# EAGLE design Coprocessor_Board (EAGLE 8.4.0)
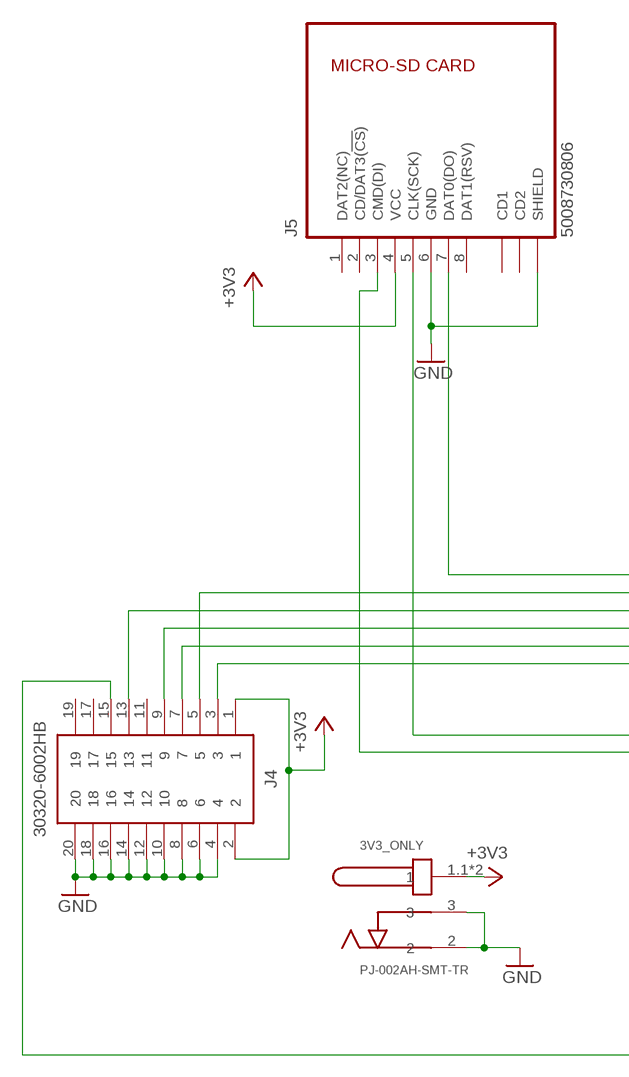
[diagram p0: schematic, sheet 1, part 1 of 2]
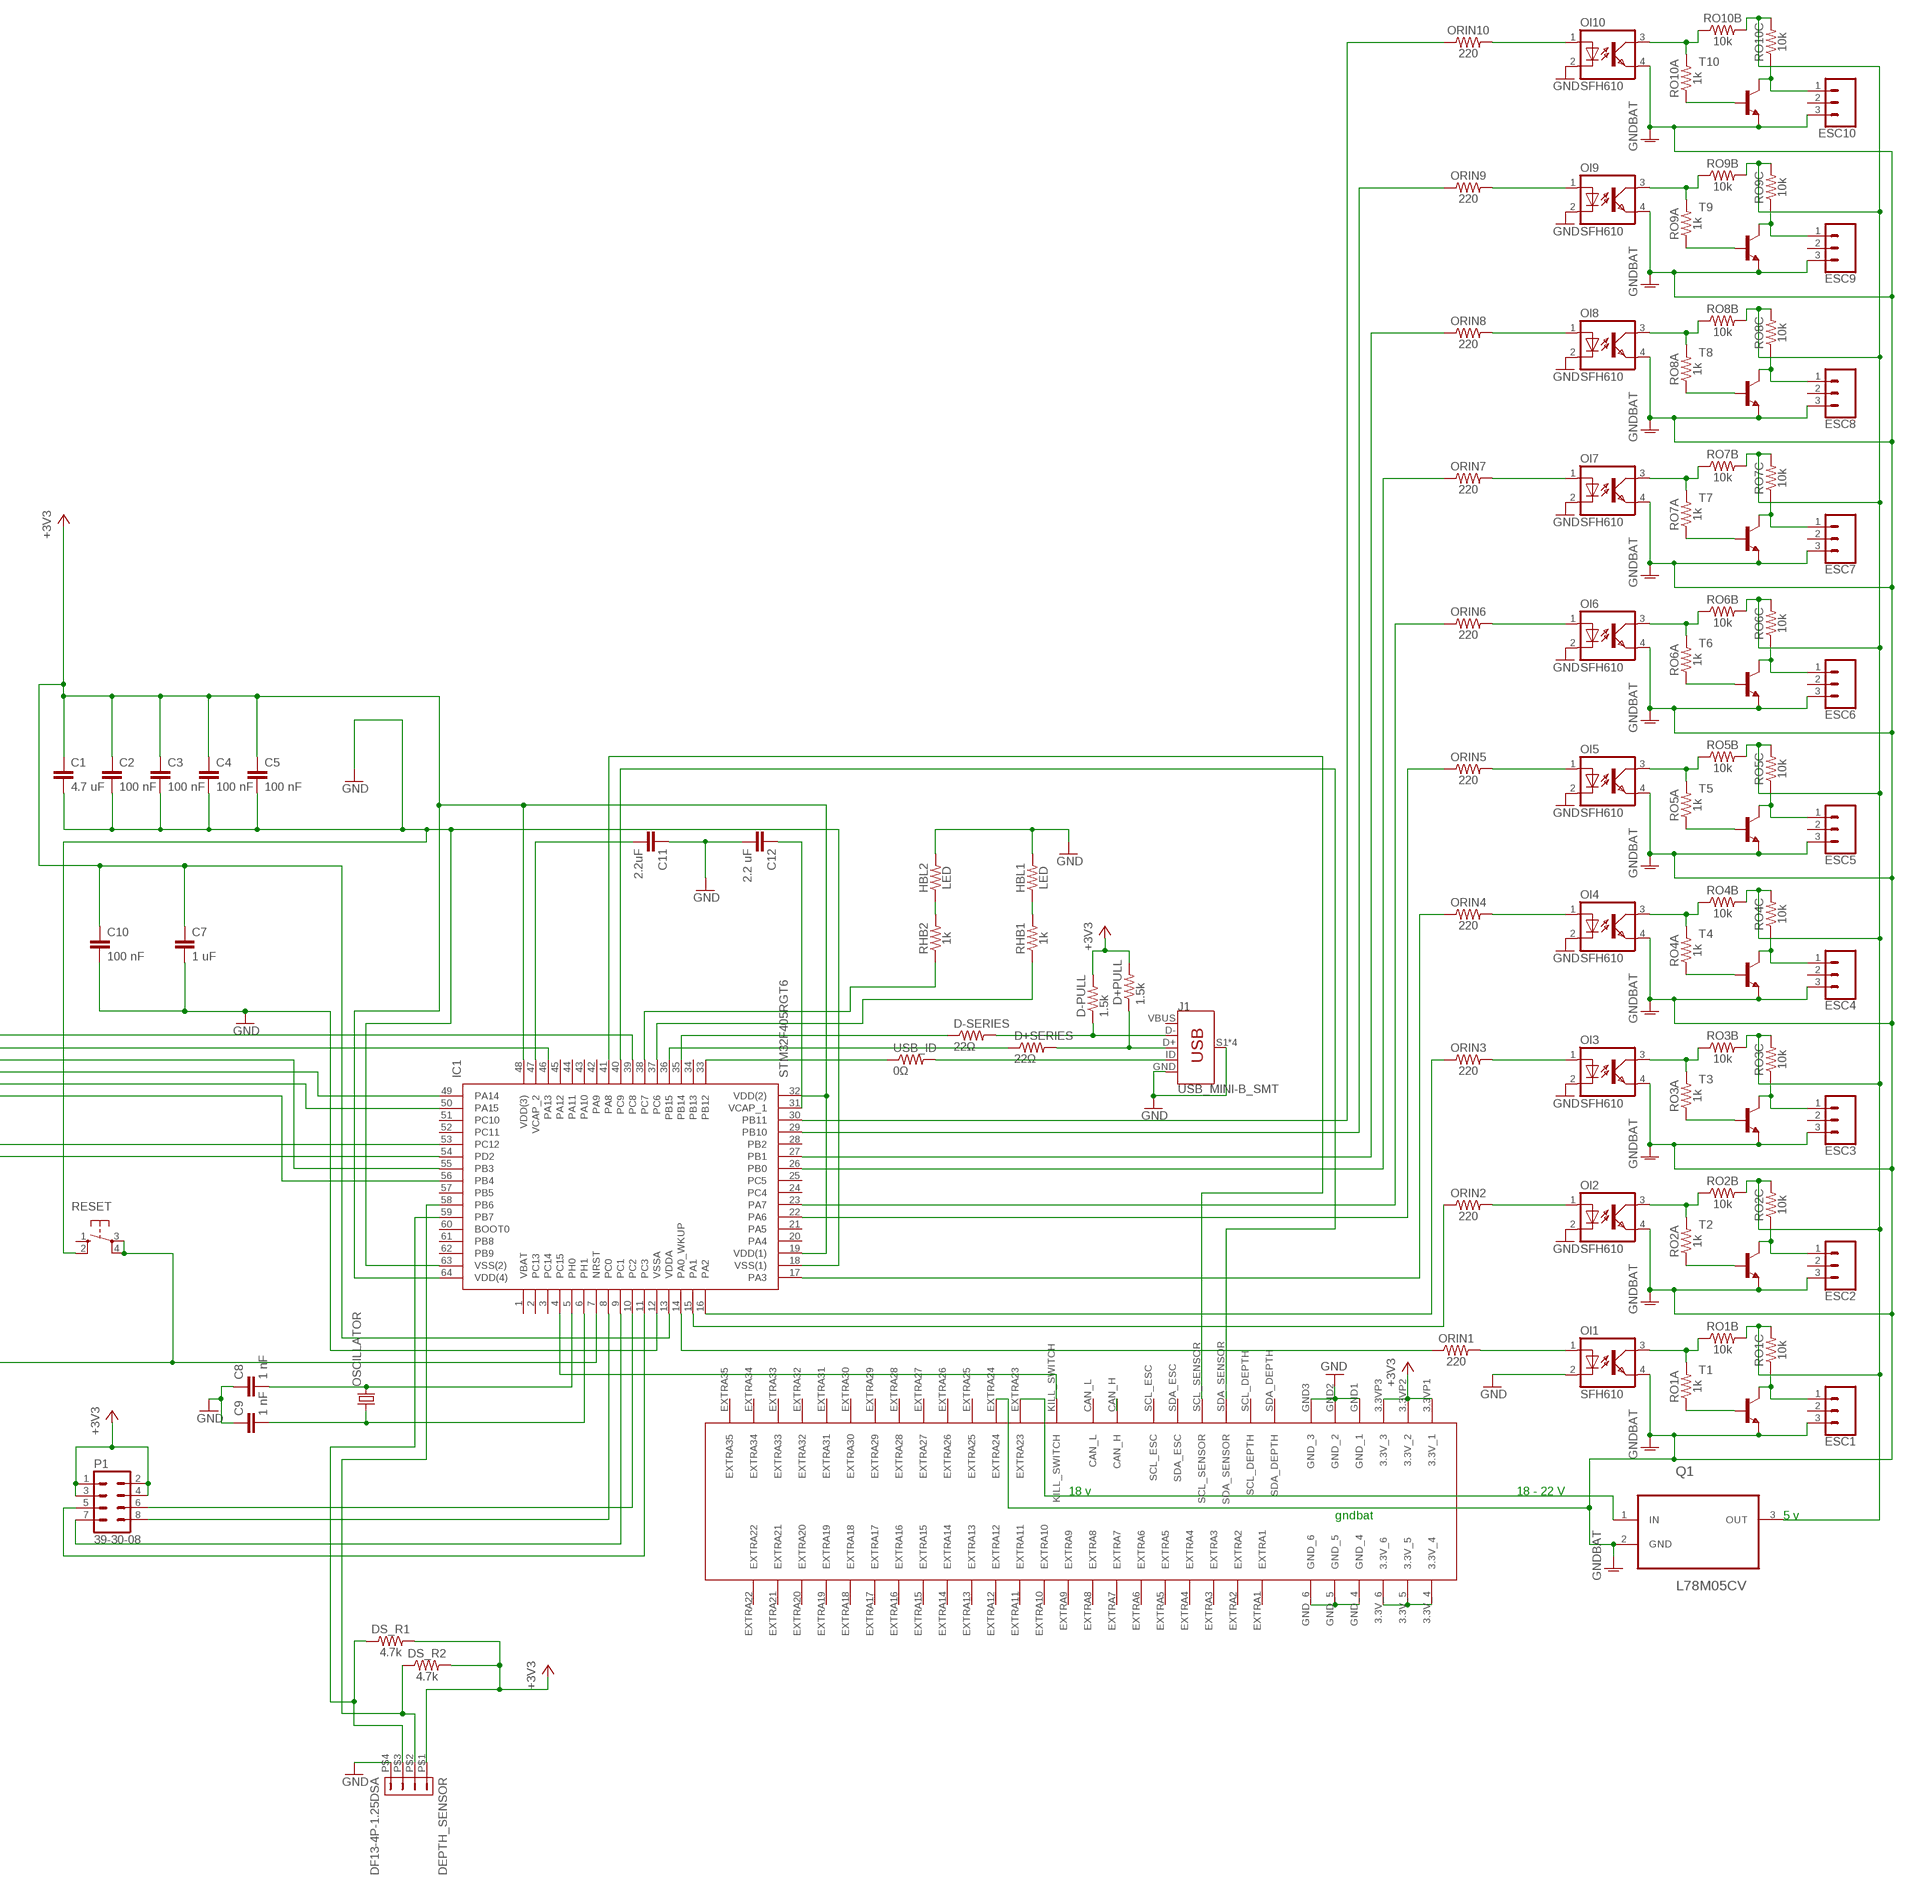
[diagram p1: schematic, sheet 1, part 2 of 2]

## Parts
3V3_ONLY  PJ-002AH-SMT-TR  [CUI_PJ-002AH-SMT-TR]
C1  4.7 uF  0.1UF-0603-100V-10%  [0603]
C2  100 nF  0.1UF-0603-100V-10%  [0603]
C3  100 nF  0.1UF-0603-100V-10%  [0603]
C4  100 nF  0.1UF-0603-100V-10%  [0603]
C5  100 nF  0.1UF-0603-100V-10%  [0603]
C7  1 uF  0.1UF-0603-100V-10%  [0603]
C8  1 nF  22PF-PTH-2.54MM-200V-5%  [CAP-PTH-2.54]
C9  1 nF  22PF-PTH-2.54MM-200V-5%  [CAP-PTH-2.54]
C10  100 nF  0.1UF-0603-100V-10%  [0603]
C11  2.2uF  0.1UF-0603-100V-10%  [0603]
C12  2.2 uF  0.1UF-0603-100V-10%  [0603]
D+PULL  1.5k  R-US_0204/7  [0204/7]
D+SERIES  22Ω  R-US_0204/7  [0204/7]
D-PULL  1.5k  R-US_0204/7  [0204/7]
D-SERIES  22Ω  R-US_0204/7  [0204/7]
DEPTH_SENSOR  DF13-4P-1.25DSA  [DF13-4P-1.25DSA]
DS_R1  4.7k  1KOHM-VERT-1/4W-1%  [AXIAL-0.1]
DS_R2  4.7k  1KOHM-VERT-1/4W-1%  [AXIAL-0.1]
ESC1  CONN_03  [1X03]
ESC2  CONN_03  [1X03]
ESC3  CONN_03  [1X03]
ESC4  CONN_03  [1X03]
ESC5  CONN_03  [1X03]
ESC6  CONN_03  [1X03]
ESC7  CONN_03  [1X03]
ESC8  CONN_03  [1X03]
ESC9  CONN_03  [1X03]
ESC10  CONN_03  [1X03]
HBL1  LED  1KOHM-VERT-1/4W-1%  [AXIAL-0.1]
HBL2  LED  1KOHM-VERT-1/4W-1%  [AXIAL-0.1]
IC1  STM32F405RGT6  [QFP50P1200X1200X160-64N]
J1  USB_MINI-B_SMT  [USB-MINIB]
J4  30320-6002HB  [SHDR20W81P254_2X10_3300X840X93]
J5  5008730806  [5008730806]
OI1  SFH610  [DIL04]
OI2  SFH610  [DIL04]
OI3  SFH610  [DIL04]
OI4  SFH610  [DIL04]
OI5  SFH610  [DIL04]
OI6  SFH610  [DIL04]
OI7  SFH610  [DIL04]
OI8  SFH610  [DIL04]
OI9  SFH610  [DIL04]
OI10  SFH610  [DIL04]
ORIN1  220  1KOHM-VERT-1/4W-1%  [AXIAL-0.1]
ORIN2  220  1KOHM-VERT-1/4W-1%  [AXIAL-0.1]
ORIN3  220  1KOHM-VERT-1/4W-1%  [AXIAL-0.1]
ORIN4  220  1KOHM-VERT-1/4W-1%  [AXIAL-0.1]
ORIN5  220  1KOHM-VERT-1/4W-1%  [AXIAL-0.1]
ORIN6  220  1KOHM-VERT-1/4W-1%  [AXIAL-0.1]
ORIN7  220  1KOHM-VERT-1/4W-1%  [AXIAL-0.1]
ORIN8  220  1KOHM-VERT-1/4W-1%  [AXIAL-0.1]
ORIN9  220  1KOHM-VERT-1/4W-1%  [AXIAL-0.1]
ORIN10  220  1KOHM-VERT-1/4W-1%  [AXIAL-0.1]
OSCILLATOR  CRYSTALHC49S  [HC49/S]
P1  39-30-08  [39-30-?08?]
Q1  L78M05CV  [TO254P450X1020X1935-3P]
RESET  10-XX  [B3F-10XX]
RHB1  1k  1KOHM-HORIZ-1/4W-1%  [AXIAL-0.3]
RHB2  1k  1KOHM-HORIZ-1/4W-5%  [AXIAL-0.3]
RO1A  1k  1KOHM-0603-1/10W-1%  [0603]
RO1B  10k  1KOHM-0603-1/10W-1%  [0603]
RO1C  10k  1KOHM-0603-1/10W-1%  [0603]
RO2A  1k  1KOHM-0603-1/10W-1%  [0603]
RO2B  10k  1KOHM-0603-1/10W-1%  [0603]
RO2C  10k  1KOHM-0603-1/10W-1%  [0603]
RO3A  1k  1KOHM-0603-1/10W-1%  [0603]
RO3B  10k  1KOHM-0603-1/10W-1%  [0603]
RO3C  10k  1KOHM-0603-1/10W-1%  [0603]
RO4A  1k  1KOHM-0603-1/10W-1%  [0603]
RO4B  10k  1KOHM-0603-1/10W-1%  [0603]
RO4C  10k  1KOHM-0603-1/10W-1%  [0603]
RO5A  1k  1KOHM-0603-1/10W-1%  [0603]
RO5B  10k  1KOHM-0603-1/10W-1%  [0603]
RO5C  10k  1KOHM-0603-1/10W-1%  [0603]
RO6A  1k  1KOHM-0603-1/10W-1%  [0603]
RO6B  10k  1KOHM-0603-1/10W-1%  [0603]
RO6C  10k  1KOHM-0603-1/10W-1%  [0603]
RO7A  1k  1KOHM-0603-1/10W-1%  [0603]
RO7B  10k  1KOHM-0603-1/10W-1%  [0603]
RO7C  10k  1KOHM-0603-1/10W-1%  [0603]
RO8A  1k  1KOHM-0603-1/10W-1%  [0603]
RO8B  10k  1KOHM-0603-1/10W-1%  [0603]
RO8C  10k  1KOHM-0603-1/10W-1%  [0603]
RO9A  1k  1KOHM-0603-1/10W-1%  [0603]
RO9B  10k  1KOHM-0603-1/10W-1%  [0603]
RO9C  10k  1KOHM-0603-1/10W-1%  [0603]
RO10A  1k  1KOHM-0603-1/10W-1%  [0603]
RO10B  10k  1KOHM-0603-1/10W-1%  [0603]
RO10C  10k  1KOHM-0603-1/10W-1%  [0603]
T1  -NPN-TO126V  [TO126V]
T2  -NPN-TO126V  [TO126V]
T3  -NPN-TO126V  [TO126V]
T4  -NPN-TO126V  [TO126V]
T5  -NPN-TO126V  [TO126V]
T6  -NPN-TO126V  [TO126V]
T7  -NPN-TO126V  [TO126V]
T8  -NPN-TO126V  [TO126V]
T9  -NPN-TO126V  [TO126V]
T10  -NPN-TO126V  [TO126V]
U$1  5530843  [5530843-6-BOARDFINGERS]
USB_ID  0Ω  R-US_0204/7  [0204/7]

## Nets
3.3V: 3V3_ONLY.1.1 3V3_ONLY.1.2 C1.1 C2.1 C3.1 C4.1 C5.1 C7.1 C10.1 D+PULL.2 D-PULL.2 DEPTH_SENSOR.P$1 DS_R1.P$2 DS_R2.P$2 IC1.13(VDDA) IC1.19(VDD(1)) IC1.32(VDD(2)) IC1.48(VDD(3)) IC1.64(VDD(4)) J4.1 J4.2 J5.4(VCC) P1.1 P1.2 P1.3 P1.4 U$1.3.3V_4 U$1.3.3V_5 U$1.3.3V_6 U$1.3.3VP1(3.3V_1) U$1.3.3VP2(3.3V_2) U$1.3.3VP3(3.3V_3) ; supply symbol labelled +3V3
5V: Q1.3(OUT) RO1B.2 RO1C.2 RO2B.2 RO2C.2 RO3B.2 RO3C.2 RO4B.2 RO4C.2 RO5B.2 RO5C.2 RO6B.2 RO6C.2 RO7B.2 RO7C.2 RO8B.2 RO8C.2 RO9B.2 RO9C.2 RO10B.2 RO10C.2
18V: Q1.1(IN) U$1.EXTRA23
CANH: U$1.CAN_H
D+CON: D+PULL.1 D+SERIES.2 J1.D+
D-CON: D-PULL.1 D-SERIES.2 J1.D-
DEPTHSCL: DEPTH_SENSOR.P$2 DS_R2.P$1 IC1.58(PB6)
DEPTHSDA: DEPTH_SENSOR.P$3 DS_R1.P$1 IC1.59(PB7)
GATE1: RO1A.1 T1.3(B)
GATE2: RO2A.1 T2.3(B)
GATE3: RO3A.1 T3.3(B)
GATE4: RO4A.1 T4.3(B)
GATE5: RO5A.1 T5.3(B)
GATE6: RO6A.1 T6.3(B)
GATE7: RO7A.1 T7.3(B)
GATE8: RO8A.1 T8.3(B)
GATE9: RO9A.1 T9.3(B)
GATE10: RO10A.1 T10.3(B)
GND: 3V3_ONLY.2 3V3_ONLY.3 C1.2 C2.2 C3.2 C4.2 C5.2 C7.2 C8.1 C9.1 C10.2 C11.1 C12.2 DEPTH_SENSOR.P$4 HBL1.P$2 HBL2.P$2 IC1.12(VSSA) IC1.18(VSS(1)) IC1.63(VSS(2)) J1.GND J1.S1(SHIELD) J1.S2(SHIELD) J1.S3(SHIELD) J1.S4(SHIELD) J4.4 J4.6 J4.8 J4.10 J4.12 J4.14 J4.16 J4.18 J4.20 J5.6(GND) J5.S3(SHIELD) J5.S4(SHIELD) OI1.2(C) OI2.2(C) OI3.2(C) OI4.2(C) OI5.2(C) OI6.2(C) OI7.2(C) OI8.2(C) OI9.2(C) OI10.2(C) RESET.2(S1) U$1.GND1(GND_1) U$1.GND2(GND_2) U$1.GND3(GND_3) U$1.GND_4 U$1.GND_5 U$1.GND_6
GNDBAT: ESC1.3 ESC2.3 ESC3.3 ESC4.3 ESC5.3 ESC6.3 ESC7.3 ESC8.3 ESC9.3 ESC10.3 OI1.4(EMIT) OI2.4(EMIT) OI3.4(EMIT) OI4.4(EMIT) OI5.4(EMIT) OI6.4(EMIT) OI7.4(EMIT) OI8.4(EMIT) OI9.4(EMIT) OI10.4(EMIT) Q1.2(GND) T1.1(E) T2.1(E) T3.1(E) T4.1(E) T5.1(E) T6.1(E) T7.1(E) T8.1(E) T9.1(E) T10.1(E) U$1.EXTRA24
HEARTBEAT_1: IC1.37(PC6) RHB1.P$1
HEARTBEAT_2: IC1.38(PC7) RHB2.P$1
HEAVE_PORT_AFT: IC1.27(PB1) ORIN8.P$1
HEAVE_PORT_FWD: IC1.26(PB0) ORIN7.P$1
HEAVE_STBD_AFT: IC1.23(PA7) ORIN6.P$1
HEAVE_STBD_FWD: IC1.22(PA6) ORIN5.P$1
JTAG15: IC1.7(NRST) J4.15 RESET.3(P) RESET.4(P1)
KILLSWITCH: IC1.4(PC15) U$1.KILL_SWITCH
MISSION_START: IC1.8(PC0) P1.8
N$1: HBL1.P$1 RHB1.P$2
N$14: HBL2.P$1 RHB2.P$2
OTG_ID: IC1.33(PB12) USB_ID.1
OTG_ID_CON: J1.ID USB_ID.2
POWER2O1: OI1.3(COL) RO1A.2 RO1B.1
POWER2O2: OI2.3(COL) RO2A.2 RO2B.1
POWER2O3: OI3.3(COL) RO3A.2 RO3B.1
POWER2O4: OI4.3(COL) RO4A.2 RO4B.1
POWER2O5: OI5.3(COL) RO5A.2 RO5B.1
POWER2O6: OI6.3(COL) RO6A.2 RO6B.1
POWER2O9: OI9.3(COL) RO9A.2 RO9B.1
POWER2O10: OI10.3(COL) RO10A.2 RO10B.1
POWER207: OI7.3(COL) RO7A.2 RO7B.1
POWER208: OI8.3(COL) RO8A.2 RO8B.1
PWM1: OI1.1(A) ORIN1.P$2
PWM2: OI2.1(A) ORIN2.P$2
PWM3: OI3.1(A) ORIN3.P$2
PWM4: OI4.1(A) ORIN4.P$2
PWM5: OI5.1(A) ORIN5.P$2
PWM6: OI6.1(A) ORIN6.P$2
PWM7: OI7.1(A) ORIN7.P$2
PWM8: OI8.1(A) ORIN8.P$2
PWM9: OI9.1(A) ORIN9.P$2
PWM10: OI10.1(A) ORIN10.P$2
RCC_OSC_IN: C8.2 IC1.5(PH0) OSCILLATOR.2
RCC_OSC_OUT: C9.2 IC1.6(PH1) OSCILLATOR.1
SCL_BKPLN: IC1.41(PA8) U$1.SCL_SENSOR
SDA_BKPLN: IC1.40(PC9) U$1.SDA_SENSOR
SDIO_CK: IC1.53(PC12) J5.5(CLK(SCK))
SDIO_CMD: IC1.54(PD2) J5.3(CMD(DI))
SDIO_DO: IC1.39(PC8) J5.7(DAT0(DO))
SOURCE1: ESC1.1 RO1C.1 T1.2(C)
SOURCE2: ESC2.1 RO2C.1 T2.2(C)
SOURCE3: ESC3.1 RO3C.1 T3.2(C)
SOURCE4: ESC4.1 RO4C.1 T4.2(C)
SOURCE5: ESC5.1 RO5C.1 T5.2(C)
SOURCE6: ESC6.1 RO6C.1 T6.2(C)
SOURCE7: ESC7.1 RO7C.1 T7.2(C)
SOURCE8: ESC8.1 RO8C.1 T8.2(C)
SOURCE9: ESC9.1 RO9C.1 T9.2(C)
SOURCE10: ESC10.1 RO10C.1 T10.2(C)
SURGEPORTHI: IC1.16(PA2) ORIN3.P$1
SURGEPORTLOW: IC1.17(PA3) ORIN4.P$1
SURGESTBDHI: IC1.14(PA0_WKUP) ORIN1.P$1
SURGESTBDLOW: IC1.15(PA1) ORIN2.P$1
SW_AFT: IC1.29(PB10) ORIN9.P$1
SW_FWD: IC1.30(PB11) ORIN10.P$1
SWITCH_3: IC1.9(PC1) P1.7
SWITCH_4: IC1.10(PC2) P1.6
SWITCH_5: IC1.11(PC3) P1.5
SYS_JTCK-SWCLK: IC1.49(PA14) J4.9
SYS_JTDI: IC1.50(PA15) J4.7
SYS_JTDO-SWO: IC1.55(PB3) J4.13
SYS_JTMS-SWIDIO: IC1.46(PA13) J4.5
SYS_JTRST: IC1.56(PB4) J4.3
USB_OTG_HS_DM: D-SERIES.1 IC1.35(PB14)
USB_OTG_HS_DP: D+SERIES.1 IC1.36(PB15)
VCAP: C11.2 IC1.47(VCAP_2)
VCAP2: C12.1 IC1.31(VCAP_1)
Unconnected: ESC1.2 ESC2.2 ESC3.2 ESC4.2 ESC5.2 ESC6.2 ESC7.2 ESC8.2 ESC9.2 ESC10.2 IC1.1(VBAT) IC1.2(PC13) IC1.3(PC14) IC1.20(PA4) IC1.21(PA5) IC1.24(PC4) IC1.25(PC5) IC1.28(PB2) IC1.34(PB13) IC1.42(PA9) IC1.43(PA10) IC1.44(PA11) IC1.45(PA12) IC1.51(PC10) IC1.52(PC11) IC1.57(PB5) IC1.60(BOOT0) IC1.61(PB8) IC1.62(PB9) J4.11 J4.17 J4.19 J5.1(DAT2(NC)) J5.2(CD/DAT3(!CS!)) J5.8(DAT1(RSV)) J5.CD1 J5.CD2 RESET.1(S) U$1.CAN_L U$1.EXTRA1 U$1.EXTRA2 U$1.EXTRA3 U$1.EXTRA4 U$1.EXTRA5 U$1.EXTRA6 U$1.EXTRA7 U$1.EXTRA8 U$1.EXTRA9 U$1.EXTRA10 U$1.EXTRA11 U$1.EXTRA12 U$1.EXTRA13 U$1.EXTRA14 U$1.EXTRA15 U$1.EXTRA16 U$1.EXTRA17 U$1.EXTRA18 U$1.EXTRA19 U$1.EXTRA20 U$1.EXTRA21 U$1.EXTRA22 U$1.EXTRA25 U$1.EXTRA26 U$1.EXTRA27 U$1.EXTRA28 U$1.EXTRA29 U$1.EXTRA30 U$1.EXTRA31 U$1.EXTRA32 U$1.EXTRA33 U$1.EXTRA34 U$1.EXTRA35 U$1.SCL_DEPTH U$1.SCL_ESC U$1.SDA_DEPTH U$1.SDA_ESC

## Notes on the sheet
- 18 v | 18 - 22 V
- gndbat | 5 v

## Power pins joined to a net without a drawn wire
VBUS: J1.VBUS

## Library data of the parts
3V3_ONLY = PJ-002AH-SMT-TR:PJ-002AH-SMT-TR: PJ-002 Series 2 x 6.5 mm 24 V Right Angle SMT Power Jack; AVAILABILITY: Good; DESCRIPTION: 24 VDC 5 A Surface Mount Unshielded 2 Conductors 3 Contacts Male Power Jack; MF: CUI; MP: PJ-002AH-SMT-TR; PACKAGE: None; PRICE: 0.98 USD
C1-C5 C7 C10-C12 = SparkFun-Capacitors:0.1UF: 0.1µF ceramic capacitors A capacitor is a passive two-terminal electrical component used to store electrical energy temporarily in an electric field.; PROD_ID: CAP-08390; VALUE: 0.1uF
C8 C9 = SparkFun-Capacitors:22PF: 22pF ceramic capacitors A capacitor is a passive two-terminal electrical component used to store electrical energy temporarily in an electric field.; PROD_ID: CAP-09128; VALUE: 22pF
D+PULL D+SERIES D-PULL D-SERIES USB_ID = resistor:R-US_: RESISTOR, American symbol
DEPTH_SENSOR = con-hirose-df13:DF13-4P-1.25: DF13-4P 1.25mm Pitch Miniature Crimping Connector.
DS_R1 DS_R2 HBL1 HBL2 ORIN1-ORIN10 = SparkFun-Resistors:1KOHM: 1kΩ resistor A resistor is a passive two-terminal electrical component that implements electrical resistance as a circuit element. Resistors act to reduce current flow, and, at the same time, act to lower voltage levels within circuits. - Wikipedia; PROD_ID: RES-12182; VALUE: 1k
ESC1-ESC10 = SparkFun-Connectors:CONN_03: Multi connection point. Often used as Generic Header-pin footprint for 0.1 inch spaced/style header connections On any of the 0.1 inch spaced packages, you can populate with these: Break Away Headers - Straight <https://www.sparkfun.com/products/116> (PRT-00116) Break Away Male Headers - Right Angle <https://www.sparkfun.com/products/553> (PRT-00553) Female Headers <https://www.sparkfun.com/products/115> (PRT-00115) Break Away Headers - Machine Pin <https://www.sparkfun.com/products/117> (PRT-00117) Break Away Female Headers - Swiss Machine Pin <https://www.sparkfun.com/products/743> (PRT-00743) Stackable Header - 3 Pin (Female, 0.1") <https://www.sparkfun.com/products/13875> (PRT-13875) For SCREWTERMINALS and SPRING TERMINALS visit here: Screw Terimnals on SparkFun.com <https://www.sparkfun.com/search/results?term=Screw+Terminals> (5mm/3.5mm/2.54mm spacing) This device is also useful as a general connection point to wire up your design to another part of your project. Our various solder wires solder well into these plated through hole pads. Hook-Up Wire - Assortment (Stranded, 22 AWG) <https://www.sparkfun.com/products/11375> (PRT-11375) Hook-Up Wire - Assortment (Solid Core, 22 AWG) <https://www.sparkfun.com/products/11367> (PRT-11367) View the entire wire category on our website here <https://www.sparkfun.com/categories/141> Special notes: Molex polarized connector foot print use with SKU : PRT-08232 with associated crimp pins and housings.; PROD_ID: XXX-00000; VALUE: 455-1750-1-ND
IC1 = STM32F405RGT6:STM32F405RGT6: MCU 32-Bit, ARM Cortex M4, 1MB Flash STMicroelectronics STM32F405RGT6, 32bit ARM Cortex M4F Microcontroller, 168MHz, 1024 kB Flash, 64-Pin LQFP <https://componentsearchengine.com/Images/3/STM32F405RGT6.jpg> Source: Datasheet <http://www.st.com/web/en/resource/technical/document/datasheet/DM00037051.pdf>; ALLIED_NUMBER: 70391099; DESCRIPTION: MCU 32-Bit, ARM Cortex M4, 1MB Flash STMicroelectronics STM32F405RGT6, 32bit ARM Cortex M4F Microcontroller, 168MHz, 1024 kB Flash, 64-Pin LQFP; HEIGHT: 1.6mm; MANUFACTURER_NAME: STMicroelectronics; MANUFACTURER_PART_NUMBER: STM32F405RGT6; RS_PART_NUMBER: 7468217; SUPPLIER_NAME: RS
J1 = SparkFun-Connectors:USB_MINI-B: USB type Mini-B Connector Breaks out 5th pin, and includes shield pins if needed. SparkFun Products: SparkFun FTDI Basic Breakout <https://www.sparkfun.com/products/9716> SparkFun XBee Explorer USB <https://www.sparkfun.com/products/11812> SparkFun Redboard <https://www.sparkfun.com/products/12757>; PROD_ID: CONN-08193; SF_ID: PRT-00587
J4 = 30320-6002HB:30320-6002HB: Header 20 position 3M 303 Series, 2.54mm Pitch 20 Way 2 Row Shrouded Straight PCB Header, Through Hole, Solder Termination <https://componentsearchengine.com/Images/3/30320-6002HB.jpg> Source: Datasheet <http://multimedia.3m.com/mws/media/22504O/3mtm-100-in-loprof-hdr-100x-100strt-ra-4-wall-ts0818.pdf>; DESCRIPTION: Header 20 position 3M 303 Series, 2.54mm Pitch 20 Way 2 Row Shrouded Straight PCB Header, Through Hole, Solder Termination; HEIGHT: 9.3mm; MANUFACTURER_NAME: 3M; MANUFACTURER_PART_NUMBER: 30320-6002HB; RS_PART_NUMBER: 8273587; SUPPLIER_NAME: RS
J5 = 5008730806:5008730806: micro SD Card Connector Molex; AVAILABILITY: Good; DESCRIPTION: Connector: for cards; SD Micro; push-push; SMT; gold plated; PIN: 8; MF: Molex; MP: 500873-0806; PACKAGE: None; PRICE: 2.47 USD
OI1-OI10 = optocoupler:SFH610: SIEMENS OPTO COUPLER; MF: VISHAY/TELEFUNKEN; MPN: SFH6106-4; OC_FARNELL: 1469568; OC_NEWARK: 58K2193
OSCILLATOR = crystal:CRYSTAL: CRYSTAL; OC_FARNELL: 1667008; OC_NEWARK: unknown
P1 = con-molex-mini-fit:39-30-?08?: HEADER
Q1 = L78M05CV:L78M05CV: Precision 500 mA regulators; AVAILABILITY: Good; DESCRIPTION: L78M05 Series 5 V 500 mA Three Terminal Positive Voltage Regulator - TO-220; MF: STMicroelectronics; MP: L78M05CV; PACKAGE: TO-220 STMicroelectronics; PRICE: 0.29 USD
RESET = switch-omron:10-XX: OMRON SWITCH; MPN: B3F-1000; OC_FARNELL: 176432; OC_NEWARK: 36M3542
RHB1 = SparkFun-Resistors:1KOHM: 1kΩ resistor A resistor is a passive two-terminal electrical component that implements electrical resistance as a circuit element. Resistors act to reduce current flow, and, at the same time, act to lower voltage levels within circuits. - Wikipedia; PROD_ID: RES-12182
RHB2 = SparkFun-Resistors:1KOHM: 1kΩ resistor A resistor is a passive two-terminal electrical component that implements electrical resistance as a circuit element. Resistors act to reduce current flow, and, at the same time, act to lower voltage levels within circuits. - Wikipedia; PROD_ID: RES-08380
RO1A RO2A RO3A RO4A RO5A RO6A RO7A RO8A RO9A RO10A = SparkFun-Resistors:1KOHM: 1kΩ resistor A resistor is a passive two-terminal electrical component that implements electrical resistance as a circuit element. Resistors act to reduce current flow, and, at the same time, act to lower voltage levels within circuits. - Wikipedia; PROD_ID: RES-07856
RO1B RO1C RO2B RO2C RO3B RO3C RO4B RO4C RO5B RO5C RO6B RO6C RO7B RO7C RO8B RO8C RO9B RO9C RO10B RO10C = SparkFun-Resistors:1KOHM: 1kΩ resistor A resistor is a passive two-terminal electrical component that implements electrical resistance as a circuit element. Resistors act to reduce current flow, and, at the same time, act to lower voltage levels within circuits. - Wikipedia; PROD_ID: RES-07856; VALUE: 1k
T1-T10 = transistor:*-NPN-: NPN Transistror BF959 corrected 2008.03.06
U$1 = 5530843-6:5530843

## Board
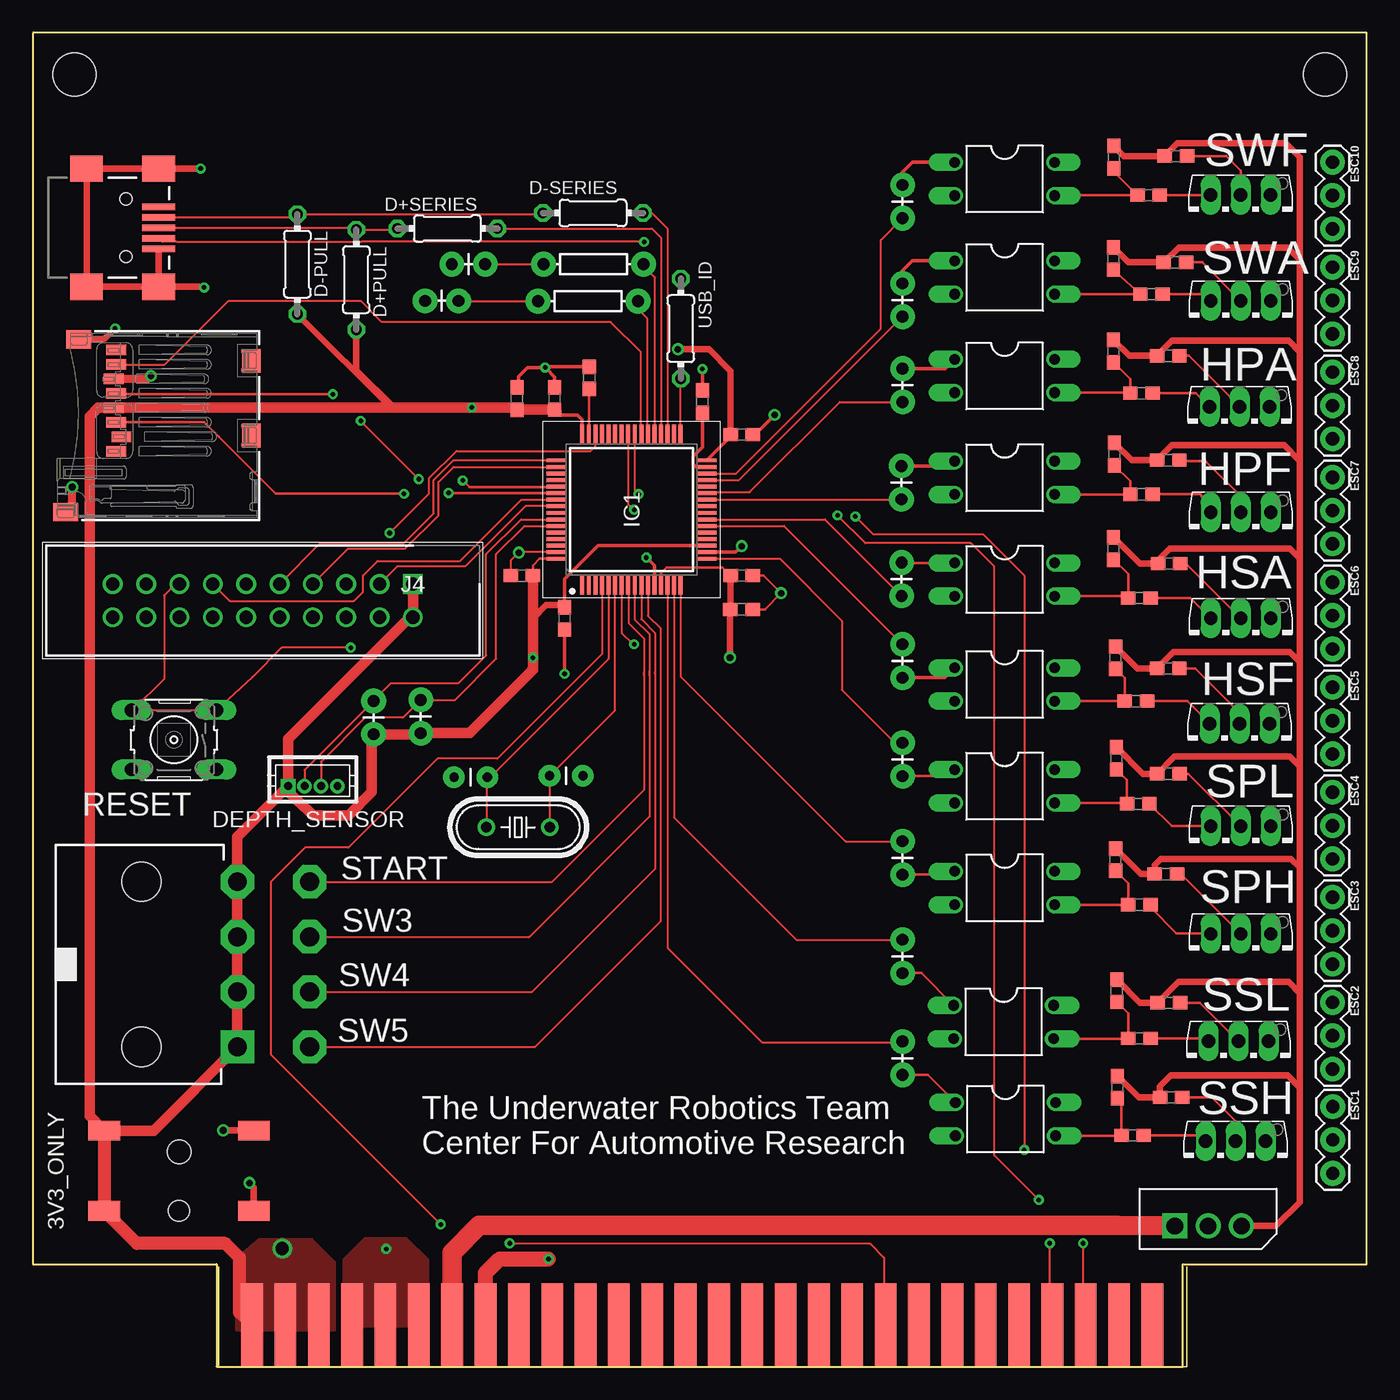
[diagram p2: board, top side]
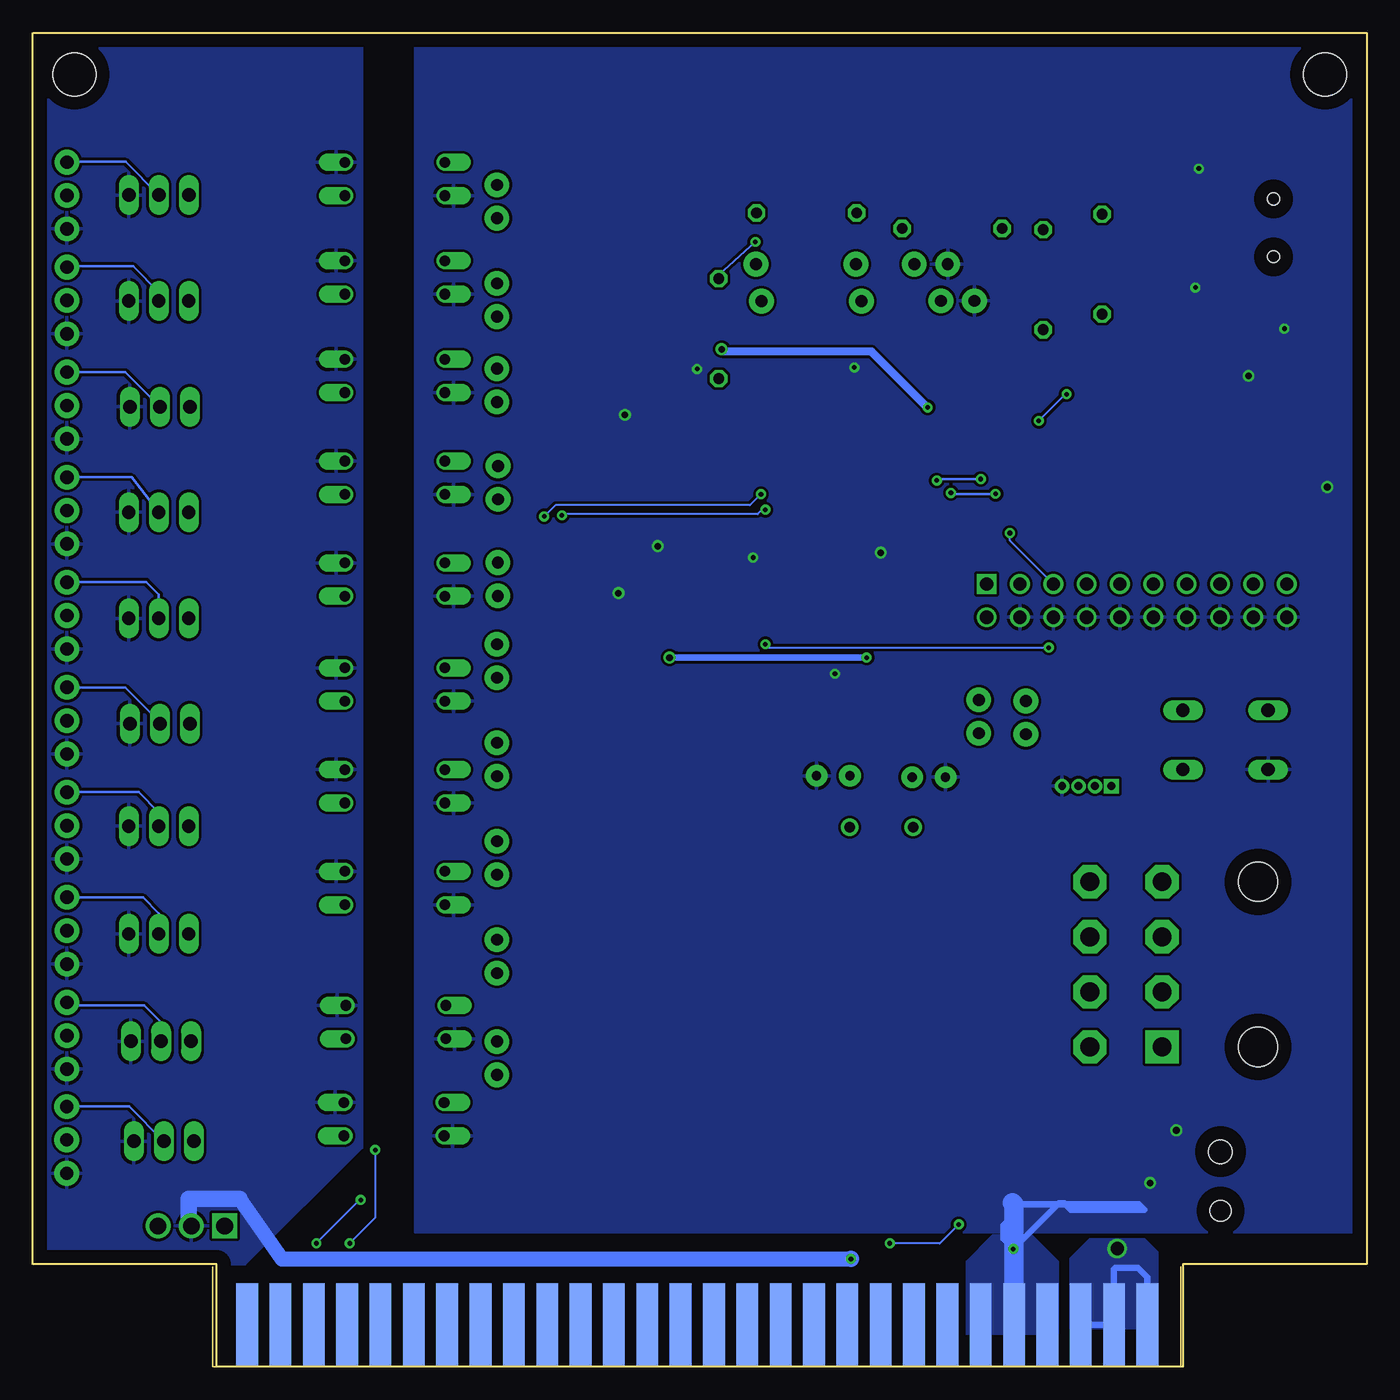
[diagram p3: board, bottom side, seen from below]

Size 101.6 x 101.6 mm. Coordinates in mm from the lower left corner, seen from the top.
Outline: 14,0 87.6,0 87.6,7.8 101.6,7.8 101.6,101.6 0,101.6 0,7.8 14,7.8 14,0
Copper layers (1*16): Top 0.035mm / dielectric 1.5mm / Bottom 0.035mm
Design rules "battery_balancer": minimum track width 6mil, minimum drill 0.35mm, track to track 0.205mm, track to pad 0.205mm, pad to pad 0.205mm, via to via 0.205mm, smd to smd 6mil, copper to edge 40mil, drill to drill 6mil, minimum pad ring 10mil, minimum via ring 8mil, stop-mask expansion 4mil, vias tented up to drill 0mil, thermal gap 10mil
Holes 3.26 mm at 3.17,98.42 98.42,98.42

### Footprints (pad centres in the part's own frame; a part is rotated, then mirrored left to right if it is on the bottom)
CUI_PJ-002AH-SMT-TR = smd 1.5 x 2.4: 1.1 -3.05,5.7; 1.2 3.05,5.7; 2 -3.05,-5.7; 3 3.05,-5.7 | hole 1.6: -3.05,0 | hole 1.8: 1.45,0
0603 = smd 1.1 x 1: 1 -0.85,0; 2 0.85,0
CAP-PTH-2.54 = drill 0.7 pad 1.651: 1 -1.27,0; 2 1.27,0
0204/7 = drill 0.813 octagon: 1 -3.81,0; 2 3.81,0
DF13-4P-1.25DSA = drill 0.6 pad 1.016 square: P$1 1.875,0 | drill 0.6 pad 1.016: P$2 0.625,0; P$3 -0.625,0; P$4 -1.875,0
AXIAL-0.1 = drill 0.9 pad 1.88: P$1 -1.27,0; P$2 1.27,0
1X03 = drill 1.016 pad 1.88: 1 0,0; 2 2.54,0; 3 5.08,0
QFP50P1200X1200X160-64N = smd 1.45 x 0.3: 1 -5.75,3.75; 2 -5.75,3.25; 3 -5.75,2.75; 4 -5.75,2.25; 5 -5.75,1.75; 6 -5.75,1.25; 7 -5.75,0.75; 8 -5.75,0.25; 9 -5.75,-0.25; 10 -5.75,-0.75; 11 -5.75,-1.25; 12 -5.75,-1.75; 13 -5.75,-2.25; 14 -5.75,-2.75; 15 -5.75,-3.25; 16 -5.75,-3.75; 33 5.75,-3.75; 34 5.75,-3.25; 35 5.75,-2.75; 36 5.75,-2.25; 37 5.75,-1.75; 38 5.75,-1.25; 39 5.75,-0.75; 40 5.75,-0.25; 41 5.75,0.25; 42 5.75,0.75; 43 5.75,1.25; 44 5.75,1.75; 45 5.75,2.25; 46 5.75,2.75; 47 5.75,3.25; 48 5.75,3.75 | smd 0.3 x 1.45: 17 -3.75,-5.75; 18 -3.25,-5.75; 19 -2.75,-5.75; 20 -2.25,-5.75; 21 -1.75,-5.75; 22 -1.25,-5.75; 23 -0.75,-5.75; 24 -0.25,-5.75; 25 0.25,-5.75; 26 0.75,-5.75; 27 1.25,-5.75; 28 1.75,-5.75; 29 2.25,-5.75; 30 2.75,-5.75; 31 3.25,-5.75; 32 3.75,-5.75; 49 3.75,5.75; 50 3.25,5.75; 51 2.75,5.75; 52 2.25,5.75; 53 1.75,5.75; 54 1.25,5.75; 55 0.75,5.75; 56 0.25,5.75; 57 -0.25,5.75; 58 -0.75,5.75; 59 -1.25,5.75; 60 -1.75,5.75; 61 -2.25,5.75; 62 -2.75,5.75; 63 -3.25,5.75; 64 -3.75,5.75
USB-MINIB = smd 2.5 x 0.5: D+ 2.5,0; D- 2.5,0.8; GND 2.5,-1.6; ID 2.5,-0.8; VBUS 2.5,1.6 | smd 2.5 x 2: S1 -3,4.5; S2 2.5,4.5; S3 -3,-4.5; S4 2.5,-4.5 | hole 0.9: 0,2.2; 0,-2.2
SHDR20W81P254_2X10_3300X840X93 = drill 1 pad 1.5 square: 1 0,0 | drill 1 pad 1.5: 2 0,2.54; 3 2.54,0; 4 2.54,2.54; 5 5.08,0; 6 5.08,2.54; 7 7.62,0; 8 7.62,2.54; 9 10.16,0; 10 10.16,2.54; 11 12.7,0; 12 12.7,2.54; 13 15.24,0; 14 15.24,2.54; 15 17.78,0; 16 17.78,2.54; 17 20.32,0; 18 20.32,2.54; 19 22.86,0; 20 22.86,2.54
5008730806 = smd 0.8 x 1.5: 1 -1.94,10.7; 2 -0.84,10.3; 3 0.26,10.7; 4 1.36,10.9; 5 2.46,10.7; 6 3.56,10.9; 7 4.66,10.7; 8 5.76,10.7 | smd 1.8 x 1.4: CD1 -0.75,0.4; CD2 4.95,0.4 | smd 1.4 x 1.9: S3 -6.575,14.55; S4 6.575,13.55
DIL04 = drill 0.813 offset: 1 -1.27,-3.81; 2 1.27,-3.81; 3 1.27,3.81; 4 -1.27,3.81
HC49/S = drill 0.813: 1 -2.413,0; 2 2.413,0
39-30-?08? = drill 1.422 pad 2.54 square: 1 6.287,0 | drill 1.422 pad 2.54 octagon: 2 2.095,0; 3 -2.095,0; 4 -6.287,0; 5 6.287,5.512; 6 2.095,5.512; 7 -2.095,5.512; 8 -6.287,5.512 | hole 3: -6.287,-7.3; 6.287,-7.3
TO254P450X1020X1935-3P = drill 1.27 square: 1 -5.08,-1.092 | drill 1.27: 2 -2.54,-1.092; 3 0,-1.092
B3F-10XX = drill 1.016 long: 1 -3.251,2.261; 2 3.251,2.261; 3 -3.251,-2.261; 4 3.251,-2.261
AXIAL-0.3 = drill 0.9 pad 1.88: P$1 -3.81,0; P$2 3.81,0
TO126V = drill 1.016 long: 1 -2.286,-1.27; 2 0,-1.27; 3 2.286,-1.27
5530843-6-BOARDFINGERS = smd 1.651 x 6.35 bottom: 3.3V_4 0.826,3.175; 3.3V_5 3.365,3.175; 3.3V_6 5.905,3.175; EXTRA1 16.066,3.175; EXTRA2 18.605,3.175; EXTRA3 21.145,3.175; EXTRA4 23.686,3.175; EXTRA5 26.226,3.175; EXTRA6 28.765,3.175; EXTRA7 31.305,3.175; EXTRA8 33.846,3.175; EXTRA9 36.386,3.175; EXTRA10 38.925,3.175; EXTRA11 41.465,3.175; EXTRA12 44.005,3.175; EXTRA13 46.545,3.175; EXTRA14 49.086,3.175; EXTRA15 51.626,3.175; EXTRA16 54.166,3.175; EXTRA17 56.706,3.175; EXTRA18 59.245,3.175; EXTRA19 61.785,3.175; EXTRA20 64.326,3.175; EXTRA21 66.865,3.175; EXTRA22 69.406,3.175; GND_4 8.445,3.175; GND_5 10.986,3.175; GND_6 13.525,3.175 | smd 1.651 x 6.35: 3.3VP1 0.826,3.175; 3.3VP2 3.365,3.175; 3.3VP3 5.905,3.175; CAN_H 51.626,3.175; CAN_L 54.166,3.175; EXTRA23 16.066,3.175; EXTRA24 18.605,3.175; EXTRA25 21.145,3.175; EXTRA26 23.686,3.175; EXTRA27 26.226,3.175; EXTRA28 28.765,3.175; EXTRA29 31.305,3.175; EXTRA30 33.846,3.175; EXTRA31 36.386,3.175; EXTRA32 38.925,3.175; EXTRA33 41.465,3.175; EXTRA34 44.005,3.175; EXTRA35 46.545,3.175; GND1 8.445,3.175; GND2 10.986,3.175; GND3 13.525,3.175; KILL_SWITCH 49.086,3.175; SCL_DEPTH 59.245,3.175; SCL_ESC 69.406,3.175; SCL_SENSOR 64.326,3.175; SDA_DEPTH 56.706,3.175; SDA_ESC 66.865,3.175; SDA_SENSOR 61.785,3.175

### Placement (x,y rotation side)
3V3_ONLY  11.14,14.93 90 top
C1  36.88,73.74 90 top
C2  39.75,73.75 90 top
C3  37.25,60.25 180 top
C4  40.5,57 270 top
C5  54,71 0 top
C7  54,60.25 0 top
C8  33.35,44.9 0 top
C9  40.63,45.01 180 top
C10  53.99,57.68 0 top
C11  42.38,75.32 270 top
C12  51,73.5 90 top
D+PULL  24.64,82.8 270 top
D+SERIES  31.58,86.69 180 top
D-PULL  20.15,83.98 270 top
D-SERIES  42.67,87.88 180 top
DEPTH_SENSOR  21.32,44.23 180 top
DS_R1  29.55,49.52 270 top
DS_R2  25.95,49.44 270 top
ESC1  99.01,19.81 270 top
ESC2  99,27.75 270 top
ESC3  99,35.75 270 top
ESC4  99,43.75 270 top
ESC5  99,51.75 270 top
ESC6  99,59.75 270 top
ESC7  99,67.75 270 top
ESC8  99,75.75 270 top
ESC9  99,83.75 270 top
ESC10  99,91.75 270 top
HBL1  33.19,83.98 180 top
HBL2  31.15,81.19 180 top
IC1  45.6,65.29 90 top
J1  7.09,86.75 0 top
J4  28.95,59.62 180 top
J5  17.06,71.67 90 top
OI1  74.09,18.85 270 top
OI2  73.94,26.26 270 top
OI3  74.03,36.46 270 top
OI4  74.03,44.21 270 top
OI5  74.03,51.96 270 top
OI6  74.03,59.96 270 top
OI7  74.03,67.71 270 top
OI8  74.03,75.46 270 top
OI9  74.03,82.96 270 top
OI10  74.03,90.46 270 top
ORIN1  66.25,23.5 270 top
ORIN2  66.25,31.25 270 top
ORIN3  66.25,38.75 270 top
ORIN4  66.25,46.25 270 top
ORIN5  66.25,53.75 270 top
ORIN6  66.18,59.98 90 top
ORIN7  66.17,67.34 90 top
ORIN8  66.25,74.75 90 top
ORIN9  66.25,81.25 90 top
ORIN10  66.25,88.75 90 top
OSCILLATOR  36.97,41.09 180 top
P1  39-30-08?  [39-30-?08?]  15.58,30.65 270 top
Q1  92.06,11.8 0 top
RESET  10.75,47.75 180 top
RHB1  42.71,83.98 180 top
RHB2  42.29,81.17 180 top
RO1A  83.77,17.63 180 top
RO1B  82.61,21.29 90 top
RO1C  86.7,20.52 180 top
RO2A  84.28,25 180 top
RO2B  82.56,28.64 90 top
RO2C  86.52,27.73 180 top
RO3A  84.28,35.19 180 top
RO3B  82.47,38.62 90 top
RO3C  86.31,37.53 180 top
RO4A  84.2,42.88 180 top
RO4B  82.53,46.34 90 top
RO4C  86.5,45.17 180 top
RO5A  84.02,50.69 180 top
RO5B  82.47,54 90 top
RO5C  86.48,53.2 180 top
RO6A  84.28,58.55 180 top
RO6B  82.32,62.33 90 top
RO6C  86.55,61.17 180 top
RO7A  84.45,66.45 180 top
RO7B  82.39,69.5 90 top
RO7C  86.48,69.04 180 top
RO8A  84.45,74.15 180 top
RO8B  82.3,77.36 90 top
RO8C  86.48,77 180 top
RO9A  85.21,81.7 180 top
RO9B  82.3,84.41 90 top
RO9C  86.99,84.11 180 top
RO10A  84.98,89.23 180 top
RO10B  82.35,92.13 90 top
RO10C  87.05,92.22 180 top
T1  91.62,15.9 180 top
T2  91.84,23.53 180 top
T3  92.01,31.7 180 top
T4  92.01,39.9 180 top
T5  91.92,47.71 180 top
T6  92.01,55.73 180 top
T7  92.01,63.81 180 top
T8  91.92,71.84 180 top
T9  92.01,79.9 180 top
T10  92,87.97 180 top
U$1  15.88,0 0 top
USB_ID  49.36,79.07 90 top

### Tracks (layer width: path | path; a pad name or v marks a point on that pad's centre or on a via)
3.3V  (via drill 0.35, 0.5, 1)
  Top 0.203: IC1.64 38.59,61.54 38.1,61.04 C3.1 | IC1.13 47.85,60.46 48.26,60.87 52.53,60.87 C7.1
  Top 0.25: C2.1 39.9,72.75 40.15,72.5 41.5,72.5 41.85,72.15 IC1.48 | 38.1,55.5 38.15,55.5 | 22.89,73.03 22.96,72.96 | C5.1 53.15,70.84 IC1.32 | C7.1 53.08,60.25 | C4.1 40.5,58 40.5,60 43.04,62.54 IC1.19
  Top 0.5: v49.13,77.5 51.5,77.5 53.15,75.85 C5.1
  Top 0.508: 38.1,57 39.1,58 40.5,58 | v38.1,54.01 37.83,52.83 | 53.08,60.25 53.14,60.19 C10.1 52.93,57.48 53.1,57.31 v53.1,54.01 | D+PULL.2 24.64,75.91 27.51,73.03 27.29,73.03 D-PULL.2
  Top 0.813: C3.1 38.1,57 38.1,55.5 38.1,53.1 37.83,52.83 33.25,48.25 DS_R1.P$2 29.47,48.17 DS_R2.P$2 25.82,48.04 25.82,43.77 24.04,41.99 21.33,41.99 20.26,43.06 20.22,43.06 19.45,43.83 DEPTH_SENSOR.P$1 | DEPTH_SENSOR.P$1 15.58,40.35 P1.4 P1.3 P1.2 P1.1 9.19,17.98 3V3_ONLY.1.2 4.32,19.09 4.32,72.38 4.97,73.03 J5.4 22.89,73.03 27.51,73.03 33.41,73.03 v33.44,73.06 36.71,73.06 C1.1 | DEPTH_SENSOR.P$1 19.45,47.81 28.72,57.09 J4.2 J4.1 | C1.1 39.76,72.89 39.9,72.75 | 36.73,73.03 C1.1
  Top 1: 3V3_ONLY.1.2 3V3_ONLY.1.1 7.92,9.39 14.66,9.39 15.74,8.31 15.74,4.14 U$1.3.3V_4
  Bottom 0.5: 52.5,54 v53.1,54.01
  Bottom 0.508: 52.5,54 39.5,54 v38.1,54.01 | U$1.3.3V_4 16.7,6.79 17.44,7.54 19.13,7.54 19.24,7.43 U$1.3.3V_5 U$1.3.3V_6
  Bottom 0.61: v33.44,73.06 37.71,77.33 48.96,77.33 v49.13,77.5
  other vias: 19,9
  pour Top (no thermals): 15.5,2.75 15.5,8.25 17.25,9.75 21.25,9.75 23,8 23,2.75
  pour Bottom (no thermals): 15.92,2.88 22.6,2.88 22.6,8.21 21.08,9.74 16.93,9.74 15.92,8.72
5V
  Top 0.508: RO9B.2 83.45,84.11 RO9C.2 87.27,85.25 95.58,85.25 96.51,84.32 | 96.51,69 96.51,77.29 | 96.51,77.29 96.51,84.32 | 96.51,84.32 96.51,92.11 95.44,93.18 87.16,93.18 RO10C.2 83.11,92.22 RO10B.2 | RO8B.2 83.51,77 RO8C.2 86.77,78.14 95.66,78.14 96.51,77.29 | 96.51,69 95.33,70.18 86.77,70.18 RO7C.2 83.7,69.04 RO7B.2 | Q1.3 94.69,10.71 96.51,12.53 96.51,21.25 | 96.51,53.67 96.51,61.55 | 96.51,45.72 96.51,53.67 | 96.51,38.01 96.51,45.72 | 96.51,28.45 96.51,38.01 | 96.51,21.25 96.51,28.45 | 96.51,61.55 96.51,69 | 96.51,61.55 95.75,62.31 86.61,62.31 85.7,61.41 RO6C.2 84.32,61.17 RO6B.2 | RO5B.2 84.13,53.2 RO5C.2 86.87,54.44 95.75,54.44 96.51,53.67 | RO4B.2 84.55,45.16 RO4C.2 86.96,46.48 95.75,46.48 96.51,45.72 | RO3B.2 84.42,37.53 RO3C.2 85.46,38.22 85.93,38.69 95.83,38.69 96.51,38.01 | RO2B.2 84.32,27.73 RO2C.2 87.24,29.29 95.66,29.29 96.51,28.45 | RO1B.2 84.23,20.52 RO1C.2 85.85,21.34 86.69,22.18 95.58,22.18 96.51,21.25
18V
  Top 1.5: U$1.EXTRA23 31.94,8.69 34,10.75 82.62,10.75 Q1.1
D+CON
  Top 0.152: J1.D+ 24.49,86.75 D+PULL.1 27.68,86.61 D+SERIES.2
D-CON
  Top 0.152: J1.D- 19.91,87.55 D-PULL.1 38.77,87.79 D-SERIES.2
DEPTHSCL
  Top 0.152: IC1.58 37.19,64.54 34.54,61.88 34.54,54.18 32.42,52.06 27.31,52.06 DS_R2.P$1 20.7,45.46 DEPTH_SENSOR.P$2
DEPTHSDA
  Top 0.152: IC1.59 37.45,64.04 35.3,61.88 35.3,53.93 32.17,50.8 DS_R1.P$1 28.2,49.44 25.31,49.44 21.95,46.08 DEPTH_SENSOR.P$3
GATE1
  Top 0.203: RO1A.1 88.88,17.63 T1.3
GATE2
  Top 0.203: RO2A.1 89.35,25 T2.3
GATE3
  Top 0.203: RO3A.1 85.13,35 87.11,33.02 89.67,33.02 T3.3
GATE4
  Top 0.203: RO4A.1 86.75,41.17 T4.3
GATE5
  Top 0.203: RO5A.1 87.92,50.69 T5.3
GATE6
  Top 0.203: RO6A.1 88.17,58.55 T6.3
GATE7
  Top 0.203: RO7A.1 88.94,66.45 T7.3
GATE8
  Top 0.203: RO8A.1 88.6,74.15 T8.3
GATE9
  Top 0.203: RO9A.1 89.19,81.7 T9.3
GATE10
  Top 0.203: RO10A.1 85.85,89.24 T10.3
GND  (via drill 0.35, 0.5)
  Top 0.152: IC1.63 37.05,62.04 v37.02,62 36.4,61.38 C3.2
  Top 0.203: C7.2 55.66,60.25 v57,58.91 55.77,57.68 C10.2
  Top 0.25: v40.5,52.78 C4.2 | C12.2 v51,76 | IC1.18 53.54,62.04 v54,62.5 | C5.2 55,71 v56.5,72.5
  Top 0.254: IC1.12 47.35,61.01 v46.73,61.63 | C1.2 37,74.7 37,75.43 37.67,76.11 v39.03,76.11 39.11,76.02 | C2.2 39.75,75.39 39.11,76.02 | C11.1 39.26,76.17 39.11,76.02
  Top 0.5: 3V3_ONLY.3 16.81,18 v14.5,18 | 3V3_ONLY.2 16.84,13.66 v16.5,14
  Top 0.508: J5.S4 5.37,78.25 5.42,78.29 5.49,78.29 v6.26,79.07 | v12.78,91.26 12.77,91.25 J1.S2 J1.S1 J1.S3 J1.S4 | J1.S4 12.99,82.25 v13.04,82.2 | J1.S4 J1.GND
  Top 0.6: J5.S3 3,65.59 v3,67 | J5.6 8.77,75.23 v9,75.47
  Bottom 0.203: 24.26,3.45 23.91,5.08 | 24.26,3.45 U$1.GND1 | 24,3.71 24.26,3.45
  Bottom 0.508: 26.86,12.36 17.36,12.36 16.93,11.94 22.52,11.94 23.03,12.45 23.45,12.45 v26.92,8.97 27.68,9.74 27.68,10.75 26.86,11.57 26.86,11.77
  Bottom 1.5: U$1.GND2 26.86,11.77 26.86,12.36 27,12.5
  pour Bottom: 0,10.25 72.5,10.25 72.5,102 0,101.5
  pour Bottom (no thermals): 23.5,2.5 23.5,8 25.5,10 28.5,10 30.5,8 30.5,2.5
  pour Top (no thermals): 23.62,3.13 30.05,3.13 30.05,8.13 28.45,9.74 25.31,9.74 23.7,8.13 23.7,3.22
GNDBAT  (via drill 0.35)
  Top 1.143: U$1.EXTRA24 34.48,7.14 35.56,8.21 v39.28,8.21
  Bottom 1.143: 85.84,12.78 82.64,8.2 39.3,8.2
  Bottom 1.27: 39.3,8.2 v39.28,8.21 | 85.84,12.78 89.74,12.78 89.74,10.93 Q1.2
  pour Bottom: 101.67,7.79 101.67,101.51 101.59,101.59 76.53,101.59 76.53,16.68 85.42,7.79
HEARTBEAT_1
  Top 0.152: IC1.37 47.41,71.1 47.41,82.97 46.52,83.85 RHB1.P$1
HEARTBEAT_2
  Top 0.152: IC1.38 46.82,71.07 46.82,79.83 46.1,80.55 RHB2.P$1
  Top 0.25: 46.87,71.06 IC1.38
HEAVE_PORT_AFT
  Top 0.152: IC1.27 51.42,66.61 54.6,66.61 61.48,73.48 ORIN8.P$1
HEAVE_PORT_FWD
  Top 0.152: IC1.26 66.13,66.04 ORIN7.P$1
HEAVE_STBD_AFT
  Top 0.152: IC1.23 60.35,64.54 ORIN6.P$1
HEAVE_STBD_FWD
  Top 0.152: IC1.22 57.23,64.04 ORIN5.P$1
JTAG15  (via drill 0.35)
  Top 0.152: IC1.7 44.85,55.89 45.72,55.03 v45.8,55.03 | v24.21,54.77 18.96,54.77 16.74,52.55 RESET.3 7.62,50.01 | 7.62,50.01 RESET.4 | J4.15 10.86,59.62 9.99,58.75 9.99,52.38 7.62,50.01
  Bottom 0.152: v45.8,55.03 45.55,54.77 v24.21,54.77
KILLSWITCH  (via drill 0.35)
  Top 0.152: IC1.4 43.35,54.27 35.39,46.31 30.82,46.31 24.04,39.53 20.74,39.53 18.12,36.91 18.12,23.79 v31.07,10.84 | U$1.KILL_SWITCH 64.85,3.29 64.85,8.3 63.75,9.4 v36.32,9.4
  Bottom 0.152: v31.07,10.84 32.51,9.4 v36.32,9.4
MISSION_START
  Top 0.152: IC1.8 45.38,59.51 45.38,56.64 46.56,55.45 46.56,53.08 | 46.56,53.08 46.56,52.83 | 46.56,52.66 46.56,43.94 39.56,36.93 P1.8 | 46.56,52.66 46.56,52.91 | 46.56,53.08 46.56,52.66
N$1
  Top 0.152: HBL1.P$1 RHB1.P$2
N$14
  Top 0.152: HBL2.P$1 32.45,81.17 RHB2.P$2
OTG_ID
  Top 0.152: IC1.33 49.35,75.59 USB_ID.1
OTG_ID_CON  (via drill 0.35)
  Top 0.152: v46.56,85.67 25.04,85.67 25.03,85.66 10.97,85.66 10.96,85.68 9.86,85.68 J1.ID
  Bottom 0.152: USB_ID.2 49.36,83.13 v46.56,85.67
POWER2O1
  Top 0.203: OI1.3 82.87,17.58 RO1A.2 82.92,20.14 RO1B.1
POWER2O2
  Top 0.203: OI2.3 83.41,24.98 RO2A.2 83.43,26.92 RO2B.1
POWER2O3
  Top 0.203: OI3.3 RO3A.2 83.43,36.81 RO3B.1
POWER2O4
  Top 0.203: OI4.3 83.29,42.94 RO4A.2 83.35,44.67 RO4B.1
POWER2O5
  Top 0.203: OI5.3 RO5A.2 83.17,52.45 RO5B.1
POWER2O6
  Top 0.203: OI6.3 83.29,58.69 RO6A.2 83.43,60.37 RO6B.1
POWER2O9
  Top 0.203: OI9.3 80.81,81.69 RO9A.2 82.5,83.37 RO9B.1
POWER2O10
  Top 0.203: OI10.3 77.87,89.23 RO10A.2 82.35,91.01 RO10B.1
POWER207
  Top 0.203: OI7.3 83.58,66.44 RO7A.2 83.6,67.44 RO7B.1
POWER208
  Top 0.203: OI8.3 83.55,74.19 RO8A.2 83.6,75.21 RO8B.1
PWM1
  Top 0.203: ORIN1.P$2 68.17,22.23 OI1.1
PWM2
  Top 0.203: ORIN2.P$2 67.68,29.98 OI2.1
PWM3
  Top 0.203: ORIN3.P$2 69.97,37.48 OI3.1
PWM4
  Top 0.203: ORIN4.P$2 69.72,44.98 OI4.1
PWM5
  Top 0.25: ORIN5.P$2 69.47,52.48 OI5.1
PWM6
  Top 0.152: 70.2,61.25 OI6.1
  Top 0.203: OI6.1 66.2,61.23 ORIN6.P$2
  Top 0.25: 70.2,61.25 OI6.1
PWM7
  Top 0.254: ORIN7.P$2 69.84,68.61 OI7.1
PWM8
  Top 0.25: ORIN8.P$2 69.51,76.02 OI8.1
PWM9
  Top 0.25: ORIN9.P$2 66.25,83.5 67,84.25 70.2,84.25 OI9.1
PWM10
  Top 0.25: ORIN10.P$2 66.25,91 67,91.75 70.2,91.75 OI10.1
RCC_OSC_IN
  Top 0.152: IC1.5 43.85,53.91 34.56,44.62 | 34.56,44.62 OSCILLATOR.2 | 34.56,44.62 34.56,44.84 C8.2
RCC_OSC_OUT
  Top 0.152: OSCILLATOR.1 39.38,44.99 C9.2 44.35,50 IC1.6
SCL_BKPLN  (via drill 0.35)
  Top 0.152: IC1.41 45.35,65.72 v45.8,65.27 | U$1.SCL_SENSOR 80,3.37 v80,9.4 80,9.48 | v76.62,12.7 73.23,16.09 73.23,60.95 71.45,62.73 63.41,62.73 v61.29,64.85
  Bottom 0.152: v45.8,65.27 46.05,65.27 46.39,64.93 61.21,64.93 v61.29,64.85 | v80,9.4 76.7,12.7 v76.62,12.7
SDA_BKPLN  (via drill 0.35)
  Top 0.152: IC1.40 45.85,66.75 v46.14,66.46 | v62.65,64.76 64,63.41 72.38,63.41 75.52,60.28 v75.52,16.51 | U$1.SDA_SENSOR 77.46,3.37 v77.46,9.4
  Bottom 0.152: v46.14,66.46 46.98,65.61 61.8,65.61 v62.65,64.76 | v75.52,16.51 75.52,11.34 v77.46,9.4
SDIO_CK  (via drill 0.35)
  Top 0.2: v32.75,67.5 33.25,67 39.81,67 IC1.53
  Top 0.203: v29.39,67.61 24.97,72.03 v24.97,72.04 | J5.5 6.42,74.08 v22.86,74.08
  Bottom 0.2: v29.39,67.61 32.64,67.61 v32.75,67.5
  Bottom 0.203: v24.97,72.04 22.94,74.08 v22.86,74.08
SDIO_CMD  (via drill 0.35)
  Top 0.2: 14.16,70.83 18.5,66.5 28.25,66.5 v28.27,66.48
  Top 0.203: IC1.54 31.68,66.54 v31.67,66.55 | 14.16,70.83 13.21,71.79 13.06,71.94 J5.3
  Bottom 0.203: v28.27,66.48 31.6,66.48 v31.67,66.55
SDIO_DO
  Top 0.152: IC1.39 46.31,71.08 46.31,77.29 44.02,79.58 26.58,79.58 24.97,81.19 14.9,81.19 10.05,76.33 J5.7
  Top 0.25: 6.44,76.25 J5.7
SOURCE1
  Top 0.203: RO1C.1 89.79,20.52 91.62,18.69 T1.2
  Bottom 0.203: T1.2 94.26,19.81 ESC1.1
SOURCE2
  Top 0.203: RO2C.1 88.91,27.73 T2.2
  Bottom 0.203: T2.2 91.84,26.23 93.12,27.51 98.76,27.51 ESC2.1
SOURCE3
  Top 0.203: RO3C.1 87.45,37.53 T3.2
  Bottom 0.203: T3.2 92.01,34.53 93.21,35.73 98.98,35.73 ESC3.1
SOURCE4
  Top 0.203: RO4C.1 88.02,45.16 T4.2
  Bottom 0.203: T4.2 92.01,42.23 93.55,43.77 98.98,43.77 ESC4.1
SOURCE5
  Top 0.203: RO5C.1 87.36,53.16 88.55,53.16 91.92,49.79 T5.2
  Bottom 0.203: ESC5.1 98.98,51.73 94.56,51.73 91.92,49.09 T5.2
SOURCE6
  Top 0.203: RO6C.1 87.84,61.17 T6.2
  Bottom 0.203: T6.2 92.01,58.82 92.95,59.77 98.98,59.77 ESC6.1
SOURCE7
  Top 0.203: 89.74,68.57 92.01,66.3 T7.2 | RO7C.1 87.38,69 89.31,69 89.74,68.57 | 89.74,68.57
  Bottom 0.203: T7.2 94.09,67.75 ESC7.1
SOURCE8
  Top 0.203: RO8C.1 88.04,77 T8.2
  Bottom 0.203: ESC8.1 94.56,75.75 T8.2
SOURCE9
  Top 0.203: RO9C.1 89.07,84.11 T9.2
  Bottom 0.203: T9.2 92.01,81.85 93.97,83.81 98.94,83.81 ESC9.1
SOURCE10
  Top 0.203: RO10C.1 87.93,92.19 90.92,92.19 92,91.12 T10.2
  Bottom 0.203: T10.2 94.53,91.77 98.98,91.77 ESC10.1
SURGEPORTHI
  Top 0.152: IC1.16 49.35,52.58 61.91,40.02 ORIN3.P$1
SURGEPORTLOW
  Top 0.152: IC1.17 56.9,61.54 61.63,56.81 61.63,51.56 65.67,47.52 ORIN4.P$1
SURGESTBDHI
  Top 0.152: IC1.14 48.35,31.91 55.54,24.72 66.2,24.72 ORIN1.P$1
SURGESTBDLOW
  Top 0.152: IC1.15 48.85,41.82 58.16,32.51 ORIN2.P$1
SW_AFT
  Top 0.152: IC1.29 53.81,67.54 ORIN9.P$1
SW_FWD
  Top 0.152: IC1.30 53.56,68.04 64.59,79.07 64.59,85.82 ORIN10.P$1
SWITCH_3
  Top 0.152: IC1.9 45.85,56.92 46.98,55.79 46.98,53.34 | 46.98,53.34 46.98,52.83 | 46.98,52.66 46.98,41.91 37.82,32.74 P1.7 | 46.98,52.66 46.98,53 | 46.98,53.34 46.98,52.66
SWITCH_4
  Top 0.152: IC1.10 46.35,56.93 47.41,55.87 47.41,53.25 | 47.41,53.25 47.41,52.83 | 47.41,52.74 47.41,37.93 38.03,28.55 P1.6 | 47.41,52.74 47.41,52.91 | 47.41,53.25 47.41,52.74
SWITCH_5
  Top 0.152: IC1.11 46.85,57.2 47.83,56.21 47.83,33.95 38.24,24.36 P1.5
SYS_JTCK-SWCLK
  Top 0.152: J4.9 21.9,62.73 28.28,62.73 30.53,64.99 30.53,67.53 32.04,69.04 IC1.49
SYS_JTDI
  Top 0.152: J4.7 24.02,62.31 28.36,62.31 30.9,64.85 30.9,66.46 30.89,66.47 30.89,66.97 30.9,66.98 30.9,67.39 32.05,68.54 IC1.50
SYS_JTDO-SWO
  Top 0.152: J4.13 15.01,58.33 24.47,58.33 25.14,59.01 25.14,60.28 26.24,61.38 32.56,61.38 37.22,66.04 IC1.55
SYS_JTMS-SWIDIO  (via drill 0.35)
  Top 0.152: v27.18,63.49 30.18,66.49 30.18,67.67 32.26,69.76 42.5,69.76 42.85,70.11 IC1.46
  Bottom 0.152: J4.5 27.18,62.93 v27.18,63.49
SYS_JTRST
  Top 0.152: IC1.56 37.52,65.54 32.93,60.95 27.74,60.95 J4.3
USB_OTG_HS_DM
  Top 0.152: D-SERIES.1 47.16,87.88 48.34,86.69 IC1.35
USB_OTG_HS_DP
  Top 0.152: D+SERIES.1 47.16,86.69 47.85,86 IC1.36
VCAP
  Top 0.203: IC1.47 42.35,74.44 C11.2
VCAP2
  Top 0.25: IC1.31 51.33,68.56 50.49,68.56 50.3,68.75 50.3,69.32 51,70.03 C12.1

### Text on the board
tPlace: START | SW3 | SW4 | SW5 | The Underwater Robotics Team / Center For Automotive Research
tNames: SWF | SWA | HPA | HPF | HSA | HSF | SPL | SPH | SSL | SSH